# EAGLE board 6_channel_esp32_energy_meter_add-on (EAGLE 9.6.0)
CREVISION: 1.0; DESIGNER: Tisham Dhar
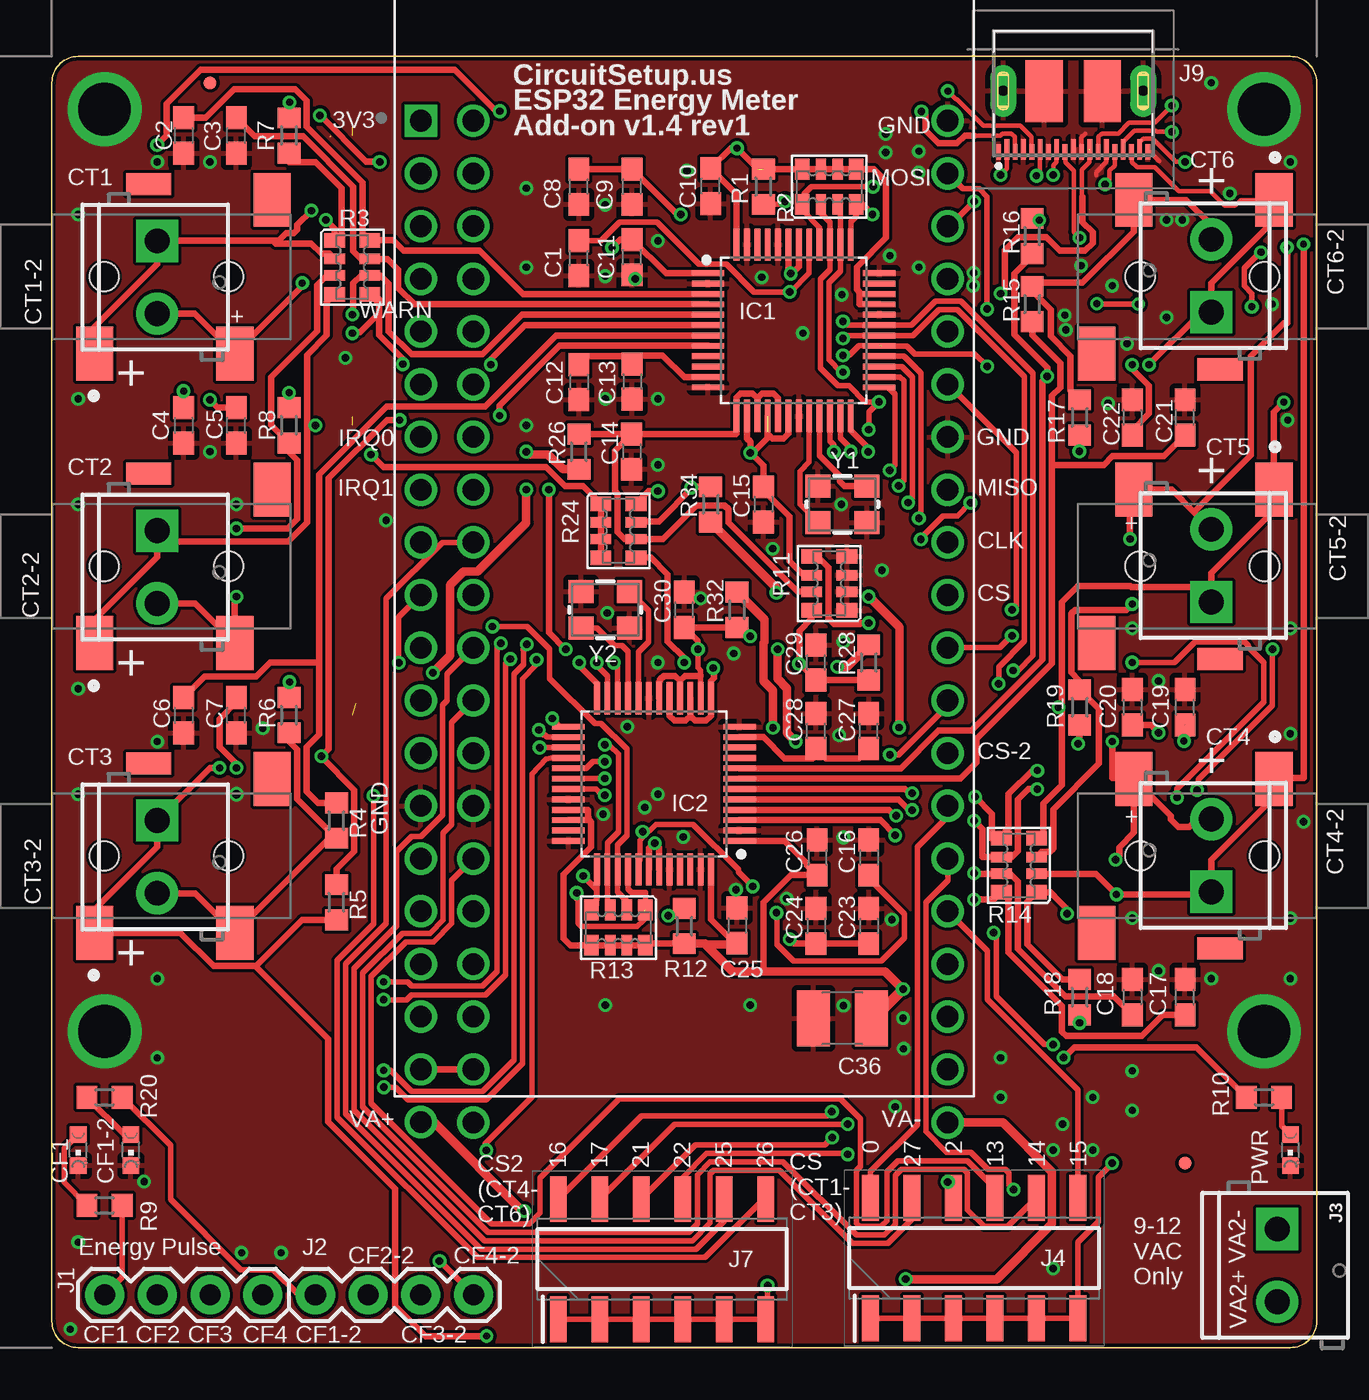
[diagram p3: board, top side]
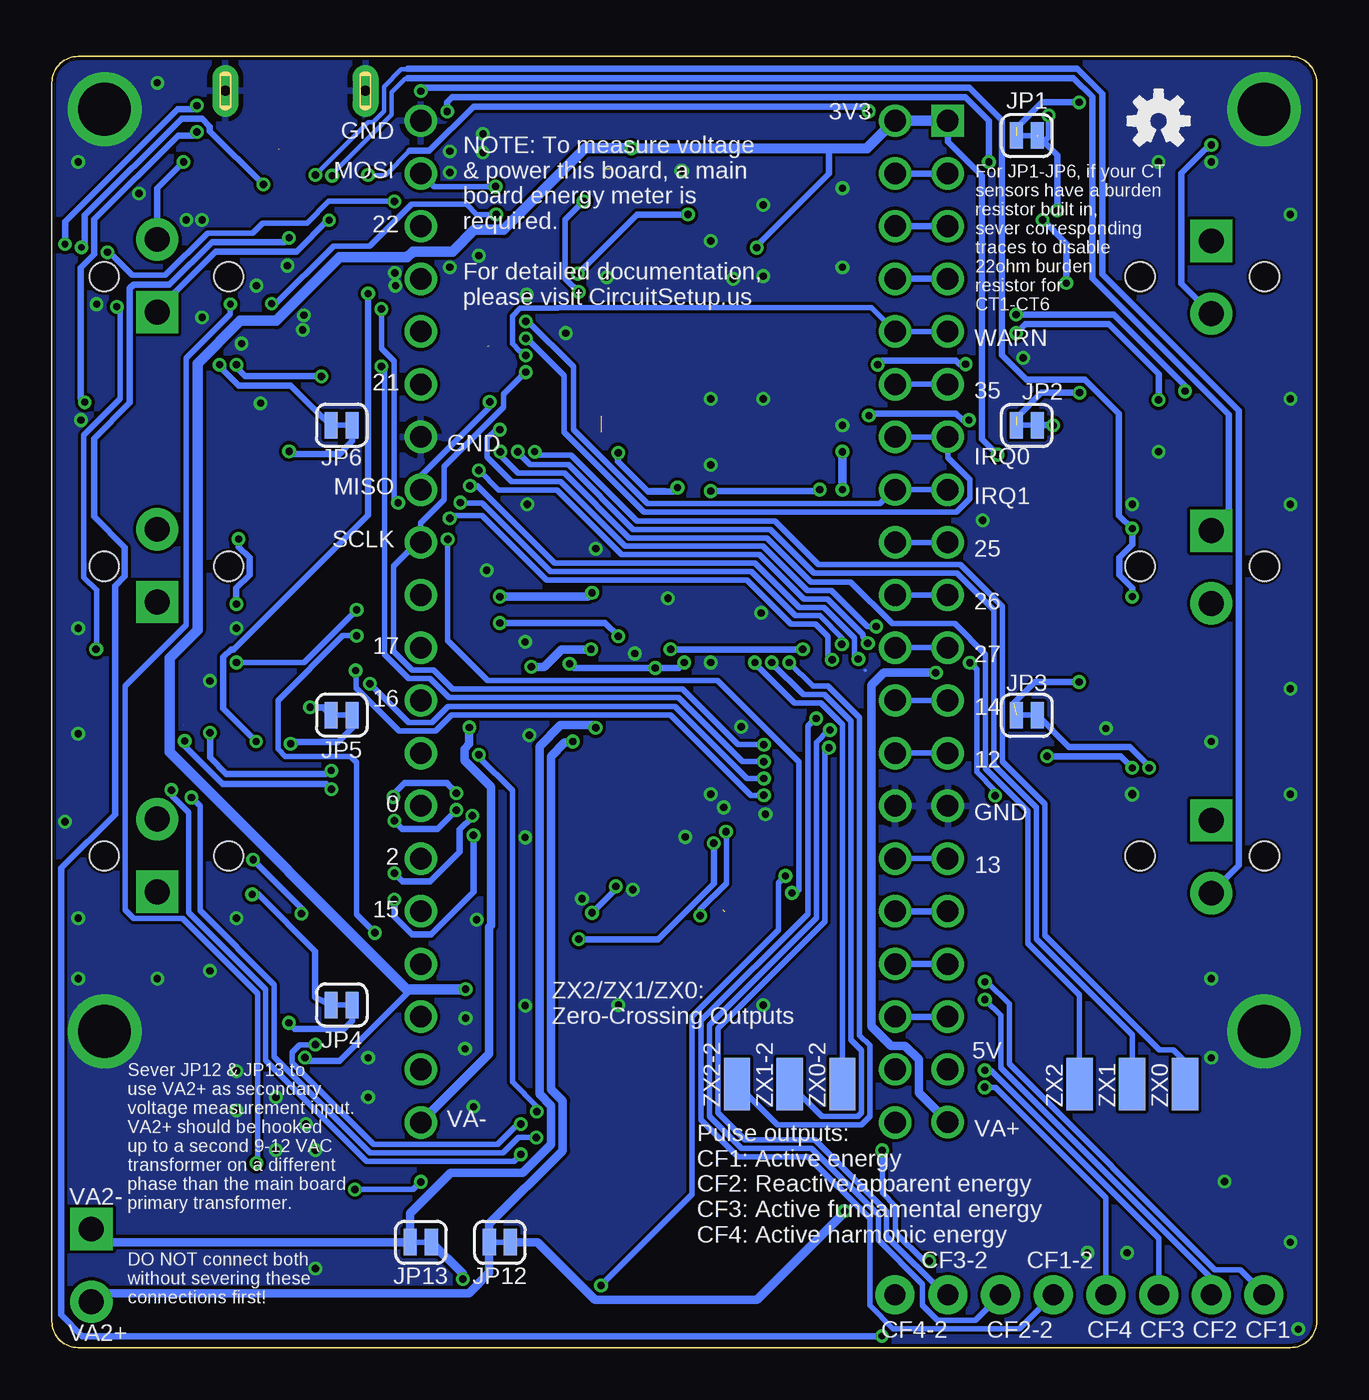
[diagram p4: board, bottom side, seen from below]

Size 60.96 x 62.23 mm. Coordinates in mm from the lower left corner, seen from the top.
Outline: 59.69,0 1.27,0 arc-90 0,1.27 0,60.96 arc-90 1.27,62.23 59.69,62.23 arc-90 60.96,60.96 60.96,1.27 arc-90 59.69,0
Copper layers (1*16): Top 0.035mm / dielectric 1.5mm / Bottom 0.035mm
Design rules "hackvana *": minimum track width 6mil, minimum drill 0.3mm, track to track 6mil, track to pad 6mil, pad to pad 6mil, via to via 6mil, smd to smd 0mil, copper to edge 6mil, drill to drill 6mil, minimum pad ring 10mil, minimum via ring 6mil, stop-mask expansion 4mil, vias tented up to drill 25mil, thermal gap 10mil
Net classes: 0 default: width 0.152 mm, drill 0.33 mm, clearance 0.152 mm; 1 pwr: width 0.305 mm, drill 0.356 mm, clearance 0.152 mm; 2 analog: width 0.203 mm, drill 0.33 mm, clearance 0.152 mm

## Footprints (pad centres in the part's own frame; a part is rotated, then mirrored left to right if it is on the bottom)
C0603 = smd 1.1 x 1: 1 -0.85,0; 2 0.85,0
C1210 = smd 1.6 x 2.7: 1 -1.4,0; 2 1.4,0
CHIPLED_0603 = smd 0.8 x 0.8: A 0,-0.75; C 0,0.75
SCREWTERMINAL-3.5MM-2 = drill 1.2 pad 2.032 square: 1 0,0 | drill 1.2 pad 2.032: 2 3.5,0
CUI_SJ2-35813B-SMT-TR = smd 1.8 x 2.6: 1 -3.7,-3.7; 2 3.05,-3.7; 10 4.85,3.7 | smd 2.184 x 1.067: 3 -1.1,4.462 | hole 1.4: -3.25,0; 2.75,0
FIDUCIAL-MICRO = smd 0.635 x 0.635: 1 0,0
QFP50P900X900X120-48 = smd 1.558 x 0.28: 1 -4.127,2.75; 2 -4.127,2.25; 3 -4.127,1.75; 4 -4.127,1.25; 5 -4.127,0.75; 6 -4.127,0.25; 7 -4.127,-0.25; 8 -4.127,-0.75; 9 -4.127,-1.25; 10 -4.127,-1.75; 11 -4.127,-2.25; 12 -4.127,-2.75; 25 4.127,-2.75; 26 4.127,-2.25; 27 4.127,-1.75; 28 4.127,-1.25; 29 4.127,-0.75; 30 4.127,-0.25; 31 4.127,0.25; 32 4.127,0.75; 33 4.127,1.25; 34 4.127,1.75; 35 4.127,2.25; 36 4.127,2.75 | smd 0.28 x 1.558: 13 -2.75,-4.127; 14 -2.25,-4.127; 15 -1.75,-4.127; 16 -1.25,-4.127; 17 -0.75,-4.127; 18 -0.25,-4.127; 19 0.25,-4.127; 20 0.75,-4.127; 21 1.25,-4.127; 22 1.75,-4.127; 23 2.25,-4.127; 24 2.75,-4.127; 37 2.75,4.127; 38 2.25,4.127; 39 1.75,4.127; 40 1.25,4.127; 41 0.75,4.127; 42 0.25,4.127; 43 -0.25,4.127; 44 -0.75,4.127; 45 -1.25,4.127; 46 -1.75,4.127; 47 -2.25,4.127; 48 -2.75,4.127
1X04 = drill 1.016 pad 1.88: 1 0,0; 2 2.54,0; 3 5.08,0; 4 7.62,0
SOP200P706X597-12N = smd 2.2 x 0.8: 1 -2.9,5; 2 -2.9,3; 3 -2.9,1; 4 -2.9,-1; 5 -2.9,-3; 6 -2.9,-5; 7 2.9,-5; 8 2.9,-3; 9 2.9,-1; 10 2.9,1; 11 2.9,3; 12 2.9,5
1X01-SM = drill 1.04: 1 0,0
PKS01940110 = smd 0.23 x 0.75: 1 3.6,5.825; 3 2.8,5.825; 5 2,5.825; 7 1.2,5.825; 9 0.4,5.825; 11 -0.4,5.825; 13 -1.2,5.825; 15 -2,5.825; 17 -2.8,5.825; 19 -3.6,5.825 | smd 0.23 x 1: 2 3.2,5.7; 4 2.4,5.7; 6 1.6,5.7; 8 0.8,5.7; 10 0,5.7; 12 -0.8,5.7; 14 -1.6,5.7; 16 -2.4,5.7; 18 -3.2,5.7 | smd 1.8 x 3: 21 -1.4,2.9; 22 1.4,2.9 | drill 0.5 pad 1.25 long: P$1 -3.375,2.875; P$2 3.375,2.875
1X19 = drill 1.04: 1 0,0; 2 2.54,0; 3 5.08,0; 4 7.62,0; 5 10.16,0; 6 12.7,0; 7 15.24,0; 8 17.78,0; 9 20.32,0; 10 22.86,0; 11 25.4,0; 12 27.94,0; 13 30.48,0; 14 33.02,0; 15 35.56,0; 16 38.1,0; 17 40.64,0; 18 43.18,0; 19 45.72,0
SMT-JUMPER_2_NC_TRACE_SILK = smd 0.635 x 1.27: 1 -0.508,0; 2 0.508,0
R0603 = smd 1 x 1.1: 1 -0.85,0; 2 0.85,0
RA1206-8 = smd 0.7 x 1: 1 -1.3,-0.85; 4 1.3,-0.85; 5 1.3,0.85; 8 -1.3,0.85 | smd 0.5 x 1: 2 -0.4,-0.85; 3 0.4,-0.85; 6 0.4,0.85; 7 -0.4,0.85
MODULE_ESP32-DEVKITC-32D = drill 1.04 square: 1 -12.7,19.76 | drill 1.04: 2 -12.7,17.22; 3 -12.7,14.68; 4 -12.7,12.14; 5 -12.7,9.6; 6 -12.7,7.06; 7 -12.7,4.52; 8 -12.7,1.98; 9 -12.7,-0.56; 10 -12.7,-3.1; 11 -12.7,-5.64; 12 -12.7,-8.18; 13 -12.7,-10.72; 14 -12.7,-13.26; 15 -12.7,-15.8; 16 -12.7,-18.34; 17 -12.7,-20.88; 18 -12.7,-23.42; 19 -12.7,-25.96; 20 12.7,19.76; 21 12.7,17.22; 22 12.7,14.68; 23 12.7,12.14; 24 12.7,9.6; 25 12.7,7.06; 26 12.7,4.52; 27 12.7,1.98; 28 12.7,-0.56; 29 12.7,-3.1; 30 12.7,-5.64; 31 12.7,-8.18; 32 12.7,-10.72; 33 12.7,-13.26; 34 12.7,-15.8; 35 12.7,-18.34; 36 12.7,-20.88; 37 12.7,-23.42; 38 12.7,-25.96
CRYSTAL-SMD-3.2X2.5MM = smd 1.2 x 1.1: 1 -1.175,-0.875; 2 1.175,-0.875; 3 1.175,0.875; 4 -1.175,0.875
SMD1,27-2,54 = smd 1.27 x 2.54: 1 0,0

## Placement (x,y rotation side)
C1  0.1uF  [C0603]  25.4,52.51 90 top
C2  .33uF  [C0603]  6.35,58.42 270 top
C3  .33uF  [C0603]  8.89,58.42 90 top
C4  .33uF  [C0603]  6.35,44.45 270 top
C5  .33uF  [C0603]  8.89,44.45 90 top
C6  .33uF  [C0603]  6.35,30.48 270 top
C7  .33uF  [C0603]  8.89,30.48 90 top
C8  10uF  [C0603]  25.4,55.95 90 top
C9  0.1uF  [C0603]  27.97,55.95 90 top
C10  0.1uF  [C0603]  31.75,55.98 90 top
C11  0.1uF  [C0603]  27.97,52.55 90 top
C12  10uF  [C0603]  25.4,46.53 270 top
C13  0.1uF  [C0603]  27.97,46.56 270 top
C14  18nF  [C0603]  27.94,43.18 270 top
C15  18nF  [C0603]  34.29,40.64 270 top
C16  0.1uF  [C0603]  39.37,23.62 270 top
C17  .33uF  [C0603]  54.61,16.89 90 top
C18  .33uF  [C0603]  52.07,16.89 270 top
C19  .33uF  [C0603]  54.61,30.86 90 top
C20  .33uF  [C0603]  52.07,30.86 270 top
C21  .33uF  [C0603]  54.61,44.83 90 top
C22  .33uF  [C0603]  52.07,44.83 270 top
C23  10uF  [C0603]  39.37,20.32 270 top
C24  0.1uF  [C0603]  36.83,20.32 270 top
C25  0.1uF  [C0603]  33.02,20.35 270 top
C26  0.1uF  [C0603]  36.88,23.62 270 top
C27  10uF  [C0603]  39.37,29.72 90 top
C28  0.1uF  [C0603]  36.83,29.72 90 top
C29  18nF  [C0603]  36.83,33.02 90 top
C30  18nF  [C0603]  30.48,35.56 90 top
C36  100uF/6.3V/1210  [C1210]  38.1,15.88 180 top
CF1  BLU  [CHIPLED_0603]  1.27,9.53 180 top
CF1-2  BLU  [CHIPLED_0603]  3.81,9.53 180 top
CT1  [SCREWTERMINAL-3.5MM-2]  5.08,53.34 270 top
CT1-2  SJ2-35813B-SMT-TR  [CUI_SJ2-35813B-SMT-TR]  5.77,51.61 0 top
CT2  [SCREWTERMINAL-3.5MM-2]  5.08,39.37 270 top
CT2-2  SJ2-35813B-SMT-TR  [CUI_SJ2-35813B-SMT-TR]  5.77,37.66 0 top
CT3  [SCREWTERMINAL-3.5MM-2]  5.08,25.4 270 top
CT3-2  SJ2-35813B-SMT-TR  [CUI_SJ2-35813B-SMT-TR]  5.77,23.7 0 top
CT4  [SCREWTERMINAL-3.5MM-2]  55.88,21.97 90 top
CT4-2  SJ2-35813B-SMT-TR  [CUI_SJ2-35813B-SMT-TR]  55.19,23.7 180 top
CT5  [SCREWTERMINAL-3.5MM-2]  55.88,35.94 90 top
CT5-2  SJ2-35813B-SMT-TR  [CUI_SJ2-35813B-SMT-TR]  55.19,37.66 180 top
CT6  [SCREWTERMINAL-3.5MM-2]  55.88,49.91 90 top
CT6-2  SJ2-35813B-SMT-TR  [CUI_SJ2-35813B-SMT-TR]  55.19,51.61 180 top
FD1  FIDUCIALUFIDUCIAL  [FIDUCIAL-MICRO]  7.62,60.96 0 top
FD2  FIDUCIALUFIDUCIAL  [FIDUCIAL-MICRO]  54.61,8.89 0 top
IC1  ATM90E32AS  [QFP50P900X900X120-48]  35.75,49.03 0 top
IC2  ATM90E32AS  [QFP50P900X900X120-48]  29.02,27.17 180 top
J1  [1X04]  10.16,2.54 180 top
J2  [1X04]  20.32,2.54 180 top
J3  [SCREWTERMINAL-3.5MM-2]  59.05,5.71 270 top
J4  TMM-103-01-T-D-SM  [SOP200P706X597-12N]  44.45,4.32 90 top
J5  PINHD1X1-SM1X01_SM  [1X01-SM]  20.32,10.85 0 top
J6  PINHD1X1-SM1X01_SM  [1X01-SM]  43.18,10.85 0 top
J7  TMM-103-01-T-D-SM  [SOP200P706X597-12N]  29.41,4.27 90 top
J8  PINHD1X1-SM1X01_SM  [1X01-SM]  17.78,10.87 0 top
J9  PKS019-4011-0  [PKS01940110]  49.23,63.45 180 top
J16  PINHD-1X19  [1X19]  20.32,59.13 270 top
JP1  [SMT-JUMPER_2_NC_TRACE_SILK]  13.97,58.42 0 bottom
JP2  [SMT-JUMPER_2_NC_TRACE_SILK]  13.97,44.45 0 bottom
JP3  [SMT-JUMPER_2_NC_TRACE_SILK]  13.97,30.48 0 bottom
JP4  [SMT-JUMPER_2_NC_TRACE_SILK]  46.99,16.51 180 bottom
JP5  [SMT-JUMPER_2_NC_TRACE_SILK]  46.99,30.48 180 bottom
JP6  [SMT-JUMPER_2_NC_TRACE_SILK]  46.99,44.45 180 bottom
JP12  [SMT-JUMPER_2_NC_TRACE_SILK]  39.37,5.08 0 bottom
JP13  [SMT-JUMPER_2_NC_TRACE_SILK]  43.18,5.08 0 bottom
LOGO1  OSHW-LOGOS  [OSHW-LOGO-S]  7.62,59.12 0 bottom
PWR  GRN  [CHIPLED_0603]  59.69,9.53 180 top
R1  10K  [R0603]  34.29,55.95 270 top
R2  10K  [RA1206-8]  37.47,55.95 0 top
R3  100  [RA1206-8]  14.48,52.07 270 top
R4  100  [R0603]  13.72,25.4 270 top
R5  100  [R0603]  13.72,21.46 270 top
R6  22  [R0603]  11.43,30.48 270 top
R7  22  [R0603]  11.43,58.42 270 top
R8  22  [R0603]  11.43,44.45 270 top
R9  1k  [R0603]  2.54,6.86 0 top
R10  1k  [R0603]  58.42,12.06 180 top
R11  1K  [RA1206-8]  37.47,36.83 90 top
R12  10K  [R0603]  30.48,20.32 90 top
R13  10K  [RA1206-8]  27.3,20.24 180 top
R14  100  [RA1206-8]  46.61,23.24 90 top
R15  100  [R0603]  47.24,50.29 90 top
R16  100  [R0603]  47.24,53.57 90 top
R17  22  [R0603]  49.53,44.83 90 top
R18  22  [R0603]  49.53,16.89 90 top
R19  22  [R0603]  49.53,30.86 90 top
R20  1k  [R0603]  2.54,12.06 0 top
R24  20K  [RA1206-8]  27.3,39.37 270 top
R26  20k 1/4W  [R0603]  25.4,43.18 270 top
R28  20k 1/4W  [R0603]  39.37,33.02 90 top
R32  20k 1/4W  [R0603]  33.02,35.56 90 top
R34  20k 1/4W  [R0603]  31.75,40.64 270 top
U1  ESP32-DEVKITC-32D  [MODULE_ESP32-DEVKITC-32D]  30.48,39.37 0 top
Y1  16.384MHz  [CRYSTAL-SMD-3.2X2.5MM]  38.1,40.64 0 top
Y2  16.384MHz  [CRYSTAL-SMD-3.2X2.5MM]  26.67,35.56 180 top
ZX0  WIREPADSMD1,27-254  [SMD1,27-2,54]  6.35,12.7 0 bottom
ZX0-2  WIREPADSMD1,27-254  [SMD1,27-2,54]  22.86,12.7 0 bottom
ZX1  WIREPADSMD1,27-254  [SMD1,27-2,54]  8.89,12.7 0 bottom
ZX1-2  WIREPADSMD1,27-254  [SMD1,27-2,54]  25.4,12.7 0 bottom
ZX2  WIREPADSMD1,27-254  [SMD1,27-2,54]  11.43,12.7 0 bottom
ZX2-2  WIREPADSMD1,27-254  [SMD1,27-2,54]  27.94,12.7 0 bottom

## Tracks (layer width: path | path; a pad name or v marks a point on that pad's centre or on a via)
!CS  (via drill 0.33, 0.36)
  Top 0.254: R2.4 38.77,54.54 38.5,54.27 IC1.37 | J4.1 J4.2 J4.3 J4.4 J4.5 J4.6 49.45,5.07 50.43,6.05 50.43,8.22 v51.1,8.89 | v52.36,50.29 50.39,50.29 v50.37,50.32
  Top 0.305: v39.55,54.61 39.06,55.1 R2.4
  Bottom 0.254: v51.1,8.89 51.05,8.94 51.05,17.07 54.66,20.68 57.01,20.68 57.43,21.09 57.43,31.88 54.48,34.83 54.48,47.69 52.36,49.82 v52.36,50.29 | v39.55,54.61 40.48,54.61 40.98,55.11 43.62,55.11 45.64,53.09 47.39,53.09 50.22,50.27 50.32,50.27 v50.37,50.32
!CS-2  (via drill 0.36)
  Top 0.254: 26,21.32 26.27,21.59 IC2.37 | R13.4 26.26,21.35 26.26,22.08 v25.6,22.73 | v34.49,3 34.49,1.45 J7.6 J7.5 J7.4 J7.3 J7.2 J7.1
  Top 0.305: 26,21.32 R13.4
  Bottom 0.254: v25.6,22.73 25.93,22.4 25.93,20.12 30.1,15.96 30.1,7.39 v34.49,3
!RESET  (via drill 0.36)
  Top 0.254: IC1.41 36.5,51.79 35.59,50.88 v35.56,50.88 33.84,50.88 32.51,52.21 31.2,52.21 29.18,54.23 27.35,54.23 26.48,53.36 C1.2 | v35.33,55.24 35.19,55.1 R1.2
  Bottom 0.254: v35.56,50.88 35.84,51.16 35.86,51.16 36.22,51.51 36.22,54.36 v35.33,55.24
!RESET2  (via drill 0.36)
  Top 0.254: 28.47,24.58 29.11,25.22 30.91,25.22 33.08,23.04 33.08,22.92 v33.78,22.23 | IC2.41 28.27,23.43 28.34,23.5 28.34,24.45 28.47,24.58 | R12.2 30.13,20.82 v29.71,20.82 | v28.47,24.87 28.47,24.58 | v34.92,20.95 34.95,20.93 34.95,19.43 35.74,18.64 39.99,18.64 41.09,19.75 41.09,20.89 39.37,22.61 C16.2
  Bottom 0.254: v29.71,20.82 29.71,21.11 28.45,22.38 28.45,24.85 v28.47,24.87 | v34.92,20.95 33.78,22.1 v33.78,22.23
CF1  (via drill 0.36)
  Top 0.254: IC1.25 40.31,46.28 40.62,45.97 40.62,42.53 v40.38,42.28 | v21.63,33.95 21.46,33.77 21.46,18.13 20.76,17.43 17.34,17.43 17.14,17.63 v15.99,17.63 | R9.2 3.39,3.39 J1.4
  Bottom 0.254: v21.63,33.95 21.63,34 21.87,34.24 21.87,34.38 23.58,36.09 24.72,36.09 26.85,38.21 33.5,38.21 36.62,41.33 39.42,41.33 v40.38,42.28 | J1.4 2.54,2.62 3.67,3.76 4.9,3.76 14.82,13.68 14.82,16.56 15.89,17.63 v15.99,17.63
CF1-2  (via drill 0.36)
  Top 0.152: v24.12,30.32 v24.13,30.32
  Top 0.254: IC2.25 24.52,29.92 v24.13,30.32 | R20.2 5.71,9.74 5.71,7.14 9.1,3.76 10.66,3.76 11.88,2.54 J2.4
  Bottom 0.152: v24.12,30.32 v24.13,30.32 24.16,30.32
  Bottom 0.254: v24.12,30.32 24.16,30.32 24.53,29.96 24.53,20.91 29.67,15.77 29.67,10.98 27.88,9.19 24.51,9.19 21.54,6.22 21.54,2.04 20.42,0.91 14.33,0.91 12.84,2.4
  Bottom 0.305: 12.84,2.4 J2.4
CF2  (via drill 0.36)
  Top 0.254: IC1.26 40.88,46.78 41.06,46.6 41.06,41.79 v40.81,41.54 | v22.09,33.19 21.86,32.96 21.86,17.96 20.91,17.01 17.34,17.01 17.1,16.77 v15.99,16.77
  Bottom 0.254: v15.99,16.77 15.23,16.01 15.23,13.49 5.08,3.34 J1.3 | v40.81,41.54 40.47,41.54 36.74,37.81 27.06,37.81 24.93,35.68 23.75,35.68 22.28,34.21 22.28,33.38 v22.09,33.19
CF2-2  (via drill 0.36)
  Top 0.254: IC2.26 23.87,29.42 23.76,29.53 23.7,29.53 v23.46,29.77
  Bottom 0.254: J2.3 16.46,1.32 18.29,1.32 19,2.04 19,3.06 21.13,5.19 21.13,6.39 24.34,9.6 27.71,9.6 29.26,11.15 29.26,15.56 24.12,20.7 24.12,29.17 23.52,29.77 v23.46,29.77
CF3  (via drill 0.36)
  Top 0.254: IC1.27 40.97,47.28 41.48,46.78 41.48,40.93 v41.27,40.73 | 22.73,33.64 22.73,32.93 22.27,32.47 22.27,13.86 20.76,12.35 17.34,12.35 16.33,13.36 v15.99,13.36
  Top 0.305: v22.89,33.91 22.89,33.8 22.73,33.64
  Bottom 0.254: v41.27,40.73 41.25,40.7 40.23,40.7 36.93,37.4 27.25,37.4 25.12,35.27 23.95,35.27 22.89,34.21 v22.89,33.91 | v15.99,13.36 15.71,13.36 7.62,5.27 J1.2
CF3-2  (via drill 0.36)
  Top 0.254: IC2.27 v23.51,28.92
  Bottom 0.254: 17.91,2.54 20.73,5.36 20.73,6.56 24.17,10 27.55,10 28.85,11.31 28.85,15.39 23.71,20.53 23.71,28.72 v23.51,28.92
  Bottom 0.305: 17.91,2.54 J2.2
CF4  (via drill 0.36)
  Top 0.254: v41.79,39.97 41.88,40.06 41.88,46.97 41.07,47.78 IC1.28 | 23.31,33.1 23.31,32.86 22.68,32.23 22.68,13.69 20.93,11.94 17.17,11.94 16.57,12.55 v16,12.55
  Top 0.305: v23.36,33.15 23.31,33.1
  Bottom 0.254: v41.79,39.97 | v41.79,39.97 41.66,40.09 40.22,40.09 37.12,36.99 27.46,36.99 25.33,34.87 24.16,34.87 23.56,34.27 23.56,33.36 v23.36,33.15 | J1.1 10.16,7.21 15.49,12.55 v16,12.55
CF4-2  (via drill 0.36)
  Top 0.254: IC2.28 24.09,28.42 23.81,28.37 23.15,27.65 23.15,12.1 20.87,9.82 21.07,9.63 v20.94,9.51 | v18.68,4.18 J2.1
  Bottom 0.254: v20.94,9.51 20.94,7.45 20.3,6.82 20.3,5.54 18.94,4.18 v18.68,4.18
GND  (via drill 0.35, 0.4, 2.54)
  Top 0.229: J9.19 | J9.11 49.62,58.34 49.8,58.52 | 50.83,57.21 J9.14 50.83,57.16 50.33,56.66 50.33,56.52 | J9.19 52.95,57.62 53.38,57.19
  Bottom 0.152: 21.79,32.64 21.73,32.65
  other vias: 40.64,11.61 4.45,8 5.08,57.15 7.62,57.15 29.21,53.34 2.54,59.69 58.42,59.69 2.54,15.24 36.2,48.9 38.05,40.64 40.39,52.63 34.21,51.59 29.21,42.55 38.07,50.75 29.21,45.72 30.61,56.72 41.78,57.66 7.62,43.18 16.1,39.88 5.08,29.21 10.16,29.84 5.08,13.97 1.27,26.67 1.27,31.75 1.27,40.64 1.27,45.72 1.27,54.61 8.89,40.64 8.89,26.67 22.86,55.88 22.86,52.07 26.67,45.72 22.86,44.45 28.12,51.51 14.15,47.7 55.88,17.78 53.34,18.16 58.42,15.24 29.21,26.67 28.57,26.04 26.77,35.41 27.73,29.93 30.43,24.61 26.57,25.7 59.69,57.15 38.15,24.59 53.34,32.13 50.9,45.52 40.18,58.5 55.88,60.96 54.48,54.36 59.56,44.7 59.69,34.67 59.69,29.59 59.69,20.7 52.07,34.67 51.82,48.39 52.07,20.7 34.75,38.51 52.07,11.43 26.67,16.51 26.67,51.64 26.67,55.07 35.41,21.64 59.69,17.78 1.27,5.08 0.89,0.89 31.27,36.12 11.05,4.57 9.14,4.57 37.95,29.51 5.08,17.78 48.26,3.81 32.97,22.07 29.21,33.02 40.01,37.47 40.49,20.62 32.87,33.45 38.15,34.01 33.66,16.51 38.15,16.48 41.78,56.64 40.18,57.61 41.78,52.07 53.72,49.66 56.77,55.63 53.72,54.36 58.8,50.29 49.61,52.15 51.1,51.18 60.33,25.35 48.87,49.05 48.82,49.76 44.42,51.79 44.4,51.18 50.16,12.06 52.07,13.34 50.16,9.53 48.26,9.53 48.72,10.77 45.72,13.97 45.72,12.06 41.02,15.88 41.05,14.4
  pour Top (rank 2): 0,62.23 61,62.23 61,0 0,0
  pour Bottom (rank 2): -0.64,62.87 61.59,62.87 61.59,-0.64 -0.64,-0.64
IA+  (via drill 0.35, 0.36)
  Top 0.229: J9.2 46.02,56.82 v45.72,56.52
  Top 0.305: R7.2 11.43,57.13 12.71,57.13 13.96,55.87 13.96,53.7 R3.1 13.63,53.94 v13.21,54.36 | v12.06,51.31 12.06,51.16 CT1-2.2 6.89,49.84 CT1.2 | v21.59,59.59 21.4,59.59 19.4,61.58 7.18,61.58 5.54,59.95 5.54,58.42 v5.08,57.96
  Bottom 0.229: v45.72,56.52 44.88,56.52 43.72,57.67
  Bottom 0.305: v13.21,54.36 12.06,53.21 v12.06,51.31 | 43.72,57.67 42.78,57.67 40.64,59.82 21.82,59.82 v21.59,59.59 | CT1.2 6.53,51.28 6.53,56.6 5.34,57.78 5.26,57.78 v5.08,57.96
IA+-2  (via drill 0.33, 0.35)  (1 unrouted)
  Top 0.229: 49.67,55.46 49.64,55.49 49.64,56.78 50.01,57.14 50.01,57.73
  Top 0.305: R18.2 48.71,17.74 47.02,19.43 47.02,21.5 R14.1 48.15,21.94 48.3,21.8 48.3,21.77 48.93,21.14 v48.93,20.91 | v51.26,23.51 51.44,23.69 51.44,24.11 52.14,24.82 CT4-2.2 | CT4.2 55.2,25.47 54.82,25.09 54.3,25.09 53.92,25.47 53.92,25.62 CT4-2.2 | v51.12,29.21 51.12,27.46 52.07,27.46 CT4-2.2 | v45.72,50.8 45.93,51.01 45.93,52.89 46.57,53.52 47.92,53.52 48.58,52.86 49.79,52.86 50.16,53.23 50.16,53.75 49.67,54.25 49.67,55.46
  Bottom 0.305: v51.26,23.51 48.93,21.18 v48.93,20.91 | v51.12,29.21 52.7,30.8 52.7,33.28 52.33,33.66 52.19,33.66 45.72,40.13 v45.72,50.8
IA-  (via drill 0.35, 0.36)  (1 unrouted)
  Top 0.229: J9.3 46.41,57.64 46.41,58.36 46.25,58.52 45.8,58.52 45.7,58.42 44.45,58.42
  Top 0.305: 13.35,52.47 R3.2 13.38,52.72 13,52.72 12.5,53.21 10.79,53.21 10.92,53.34 | CT1-2.1 2.07,49.21 5.08,52.23 CT1.1 10.92,53.34 | 10.92,53.34 11.29,53.71 11.64,53.71 11.82,53.89 11.82,54.11 v12.51,54.8 | v15.8,57.15 15.15,57.15 v12.92,59.38 | v41.91,59.58 42.09,59.4 42.09,58.68 42.73,58.05 43.63,58.05 44,58.42 44.45,58.42
  Bottom 0.305: v12.51,54.8 12.51,57.47 13.16,58.12 | 13.16,58.12 13.41,58.37 | v12.92,59.38 12.92,58.35 13.16,58.12 | v15.8,57.15 15.8,59.14 16.93,60.27 41.66,60.27 41.91,60.03 v41.91,59.58
IA--2  (via drill 0.33, 0.35)
  Top 0.229: v53.98,59.86 53.15,59.03 51.91,59.03 51.4,58.52 50.6,58.52 50.44,58.36 50.44,57.64 J9.13
  Top 0.305: R14.2 50.31,22.84 v51.31,21.84 55.75,21.84 CT4.1 55.88,23.5 58.89,26.51 CT4-2.1 58.9,27.46 60.33,27.46 v60.33,53.18
  Bottom 0.305: JP4.2 48.26,16.89 48.26,19.1 51,21.84 v51.31,21.84 | v53.98,59.86 54.15,59.68 54.9,59.68 60.33,54.26 v60.33,53.18
IAN
  Top 0.305: C3.2 9.79,58.38 12.11,58.38 14.52,55.96 14.52,52.84 14.89,52.47 R3.7 16.18,52.47 16.7,51.95 16.7,51.06 17.48,50.28 IC1.4
IAN-2  (via drill 0.36)
  Top 0.305: C18.2 51.17,16.94 48.85,16.94 46.56,19.23 46.56,22.47 46.25,22.78 45.82,22.78 R14.7 44.47,22.84 v44.45,22.86 | IC2.4 40.35,25.92 40.64,25.63 v40.69,25.63
  Bottom 0.305: v40.69,25.63 40.69,25.58 41.31,24.96 41.31,23.88 42.73,22.46 44.06,22.46 v44.45,22.85 v44.45,22.86
IAP
  Top 0.305: C2.1 7.41,59.27 8.79,60.65 11.72,60.65 12.29,60.09 12.29,58.84 14.98,56.15 14.98,53.72 R3.8 16.44,53.37 16.95,52.86 20.62,52.86 22.71,50.78 IC1.3
IAP-2  (via drill 0.36)
  Top 0.305: C17.1 53.55,16.04 52.52,15.01 48.89,15.01 48.67,15.23 48.67,16.47 46.11,19.04 46.11,21.59 R14.8 45.41,21.59 v44.45,21.59 | IC2.3 39.93,25.42 40.64,24.71 v40.64,24.69
  Bottom 0.305: v44.45,21.59 v44.44,21.58 44.44,20.76 43.6,19.92 42.68,19.92 40.64,21.96 v40.64,24.69
IB+  (via drill 0.35)
  Top 0.229: v43.18,60.56 43.56,60.18 43.61,60.18 44.89,58.9 46.67,58.9 47.21,58.36 47.21,57.64 J9.5
  Top 0.305: R3.3 13.25,51.67 12.79,51.22 12.79,48.99 10.57,46.77 10.57,44.45 R8.2 11.43,43.17 11.82,42.78 11.82,39.93 11.37,39.47 v8.89,39.47 | CT2.2 6.9,35.87 CT2-2.2 8.82,36.12 v8.89,36.2
  Bottom 0.229: v43.18,60.56 43.18,60.68 43.12,60.73
  Bottom 0.305: v8.89,36.2 8.89,36.61 9.52,37.24 9.52,38.07 8.89,38.7 v8.89,39.47 9.53,40.11 9.53,45.01 11.17,46.66 14,46.66 15.16,47.82 15.16,59.15 16.74,60.73 43.12,60.73
IB+-2  (via drill 0.33, 0.35)
  Top 0.229: 51.24,57.64 J9.15 51.23,56.97 50.97,56.71 50.97,56.26 v50.76,56.06
  Top 0.305: v52.07,35.84 51.79,35.56 49.32,35.56 49.14,35.38 49.14,32.53 49.53,32.14 R19.2 50.47,30.77 50.47,28.15 48.26,25.95 48.26,24.07 48.08,23.88 47.7,23.88 R14.3 | 55.04,40.28 53.97,41.35 CT5-2.2 52.07,41.27 51.96,41.17 v51.96,38.97 | 55.04,40.28 CT5.2 | v59.53,53.02 59.53,49.37 59.37,49.37 57.78,47.78 57.78,43.02 55.04,40.28
  Bottom 0.305: v52.07,35.84 52.07,36.61 51.44,37.24 51.44,38.07 51.96,38.59 v51.96,38.97 | v59.53,53.02 59.37,53.19 59.37,54.57 54.71,59.22 53.71,59.22 53.34,58.85 53.34,58.64 v50.76,56.06
IB-  (via drill 0.35)
  Top 0.229: v47.45,56.48 47.62,56.65 J9.6
  Top 0.305: 12.29,44.45 12.29,47.84 13.25,48.8 13.25,50.39 R3.4 | 12.29,44.45 v12.7,44.45 | CT2-2.1 2.07,35.09 5.08,38.1 CT2.1 5.61,38.84 11.38,38.84 12.29,39.75 12.29,44.45
  Bottom 0.229: v47.45,56.48 47.45,56.55 45.32,58.68 44.58,59.42 44.58,60.51 43.93,61.15 43.85,61.15 43.81,61.19
  Bottom 0.305: JP2.2 v12.7,44.45 | CT2.1 4.24,40.21 4.24,44.96 10.82,51.54 10.82,60.28 11.73,61.19 43.81,61.19
IB--2  (via drill 0.33, 0.35)
  Top 0.229: J9.16 51.64,57.77 51.64,58.11 52.18,58.65 53.21,58.65 53.26,58.59 v53.98,58.59
  Top 0.305: 48.67,30.86 48.67,35.94 49.44,36.7 51.98,36.7 52.03,36.65 55.17,36.65 CT5.1 55.88,37.33 58.89,40.34 CT5-2.1 58.9,41.43 58.9,45.09 v59.37,45.56 | 48.67,30.86 48.67,27.11 47.79,26.23 47.79,24.87 R14.4 | 48.67,30.86 v48.51,30.86
  Bottom 0.305: v48.51,30.86 47.88,30.86 JP5.2 | v59.37,45.56 59.56,45.75 59.56,52.04 58.91,52.69 58.91,54.38 54.87,58.42 54.15,58.42 v53.98,58.59
IBN  (via drill 0.35)
  Top 0.305: C5.2 8,45.3 v7.62,45.68 | v14.48,48.9 14.51,48.93 14.86,48.93 15.78,49.85 15.78,50.32 R3.5 15.55,50.77 15.78,50.54 15.78,48.79 16.92,47.65 v16.92,47.4 | v21.16,47.38 21.16,47.62 22.81,49.28 IC1.6
  Bottom 0.305: v16.92,47.4 17.22,47.4 17.38,47.57 20.97,47.57 v21.16,47.38 | v7.62,45.68 7.62,46.92 10.03,49.33 14.05,49.33 v14.48,48.9
IBN-2  (via drill 0.35, 0.36)
  Top 0.305: C20.2 52.96,30.01 v53.34,29.64 | IC2.6 41.11,26.92 41.31,26.72 v41.46,26.72 | v44.5,26.54 45.31,25.73 45.31,24.52 45.74,24.52 R14.5 45.76,24.67 46.11,25.02 46.11,26.68 47.24,27.81 v47.5,27.81
  Bottom 0.305: v53.34,29.64 53.34,28.43 52.56,27.66 47.78,27.66 47.63,27.8 v47.5,27.8 v47.5,27.81 | v41.46,26.72 41.92,27.18 41.92,27.22 43.96,27.22 44.5,26.68 v44.5,26.54
IBP  (via drill 0.35)
  Top 0.305: C4.1 v6.35,46.1 | IC1.5 22.66,49.78 20.77,47.88 17.33,47.88 16.24,48.98 16.24,51.28 15.85,51.67 R3.6 14.89,51.67 14.52,51.3 14.52,49.83 v14.48,49.79
  Bottom 0.305: v14.48,49.79 9.78,49.79 6.35,46.35 v6.35,46.1
IBP-2  (via drill 0.35, 0.36)  (1 unrouted)
  Top 0.152: 54.61,29.21 54.59,29.23 v54.56,29.23
  Top 0.305: C19.1 54.61,29.21 | IC2.5 40.8,26.42 41.31,25.91 v41.46,25.91 | v44.45,25.4 44.86,24.99 44.86,23.64 R14.6 46.27,23.64 46.56,23.94 46.56,26.42 47.06,26.92 v47.49,26.92
  Bottom 0.305: v54.56,29.23 54.56,29.01 52.73,27.17 47.75,27.17 v47.49,26.92 | v41.46,25.91 42.37,25 44.09,25 44.45,25.36 v44.45,25.4
IC+  (via drill 0.35)
  Top 0.229: v48.26,56.52 48.26,56.99 48.41,57.14 48.41,57.73 J9.8
  Top 0.305: R6.2 11.43,29.21 11.82,28.82 11.82,26.45 R4.2 13.37,24.55 CT3-2.2 6.91,21.9 CT3.2
  Bottom 0.229: 43.81,61.65 43.85,61.61 44.12,61.61 44.96,60.77 44.96,59.58 45.48,59.06 45.72,59.06 v48.26,56.52
  Bottom 0.305: CT3.2 5.08,21.92 3.76,23.24 3.76,45.16 10.34,51.74 10.34,60.44 11.54,61.65 43.81,61.65
IC+-2  (via drill 0.35)
  Top 0.229: J9.18 52.44,57.77 52.44,58.11 52.6,58.27 53.05,58.27 54.17,57.15 v54.61,57.15
  Top 0.305: R17.2 49.1,46.11 49.1,47.8 48.15,48.75 48.15,50.02 47.24,50.92 R15.2 47.42,51.32 49.67,51.32 52.14,53.79 CT6-2.2 54.68,55.31 55.88,54.12 CT6.2
  Bottom 0.305: v54.61,57.15 55.88,55.88 CT6.2
IC-  (via drill 0.33, 0.35)
  Top 0.229: J9.9 48.84,57.61 48.84,57.14 49.25,56.73 49.25,53.77 v49.53,53.49
  Top 0.305: 9.84,18.39 7.79,18.39 6.18,20 CT3-2.1 2.07,21.12 5.08,24.13 CT3.1 7.62,27.94 v8.08,27.94 | R5.2 12.06,20.61 9.84,18.39 | 9.84,18.39 9.82,18.37 13.31,14.88 13.31,10.87 16.54,7.64 16.54,2.02 18,0.56 v20.95,0.56
  Bottom 0.305: JP3.2 11.94,28.96 9.01,28.96 8.08,28.03 v8.08,27.94 | v20.95,0.56 59.49,0.56 60.5,1.57 60.5,23.11 57.91,25.7 57.91,36.7 57.44,37.18 57.44,38.56 58.93,40.05 58.93,43.82 57.2,45.55 57.2,51.05 57.02,51.23 55.3,51.23 53.24,53.29 49.73,53.29 v49.53,53.49
IC--2  (via drill 0.33, 0.35)
  Top 0.229: 52.04,57.64 J9.17 52.04,57.61 52.04,57.14 52.3,56.88 53.16,56.88 54.3,55.73 55.82,55.73 56.52,55.03 57.02,55.03 57.3,55.31 CT6-2.1
  Top 0.305: CT6-2.1 58.89,54.32 55.88,51.31 CT6.1 55.42,49.91 v52.88,47.37 | v47.6,54.34 47.33,54.34 R16.2
  Bottom 0.305: JP6.2 47.88,44.83 47.92,44.83 49.45,46.35 51.95,46.35 52.7,47.11 52.7,47.24 52.83,47.37 v52.88,47.37 | v47.6,54.34 47.66,54.34 49.17,52.83 53.05,52.83 55.88,50.01 CT6.1
ICN  (via drill 0.35)
  Top 0.305: v16.76,44.7 16.15,44.7 13.35,41.9 13.35,28.85 v12.99,28.5 12.99,28.46 14.57,26.88 14.57,23.92 13.72,23.07 R5.1 | C7.2 8.89,31.11 8.09,30.31 8.09,28.95 8.89,28.15 v8.89,27.94 | IC1.8 24.46,48.28 21.58,45.4 v21.58,44.92
  Bottom 0.305: v16.76,44.7 17.06,44.7 17.38,45.03 21.48,45.03 v21.58,44.92 | v8.89,27.94 9.45,28.5 v12.99,28.5
ICN-2  (via drill 0.35)
  Top 0.305: C22.2 52.07,44.2 52.88,45.01 52.88,46.36 52.07,47.16 v52.07,47.37 | R16.1 47.24,52.62 46.39,51.77 46.39,48.82 47.97,47.23 v47.97,46.81 47.74,46.59 47.74,33.16 44.32,29.73 42.73,29.73 40.91,27.92 IC2.8
  Bottom 0.305: v47.97,46.81 51.64,46.81 52.07,47.24 v52.07,47.37
ICP
  Top 0.305: 12.89,33.02 12.89,42.09 16.14,45.34 20.87,45.34 24.31,48.78 IC1.7 | 12.89,33.02 12.89,29.56 12.28,28.96 12.28,26.8 12.83,26.25 R4.1 | 12.89,33.02 10.51,33.02 9.84,32.35 7.37,32.35 C6.1
ICP-2
  Top 0.305: 48.2,42.55 48.2,45.88 48.6,46.28 48.6,47.45 47.24,48.81 R15.1 | 48.2,42.55 48.2,32.97 44.57,29.34 44.57,28.2 43.79,27.42 IC2.7 | 48.2,42.55 50.7,42.55 51.12,42.96 53.59,42.96 C21.1
IO0
  Top 0.254: J4.12 39.45,8.49 41.71,10.74 41.71,24.13 43.18,25.6 U1.33
IO2  (via drill 0.36)
  Top 0.254: U1.34 43.18,22.53 42.11,21.46 42.11,10.41 43.12,9.41 44.3,9.41 45.12,8.6 45.97,8.6 46.13,8.43 46.13,7.85 v46.35,7.62 | v43.18,7.99 43.45,7.72 J4.10
  Bottom 0.254: v46.35,7.62 43.55,7.62 v43.18,7.99
IO12
  Bottom 0.254: U1.13 J16.13
IO13
  Top 0.254: J16.15 19.26,22.51 19.26,20.44 18.39,19.56 17.06,19.56 15.38,17.88 15.38,11.77 21.18,5.97 23.01,5.97 23.54,6.5 23.54,8.19 27.34,11.99 38,11.99 38.96,11.02 38.96,8.73 38.77,8.54 38.77,6 38.93,5.84 39.97,5.84 40.24,6.12 40.24,8.48 40.77,9 44.13,9 45.45,7.69 J4.9
  Bottom 0.254: U1.15 J16.15
IO14
  Top 0.254: J16.12 19.26,30.13 19.26,25.21 18.85,24.8 18.85,20.61 18.22,19.97 16.9,19.97 14.97,18.05 14.97,11.6 21.02,5.56 30.7,5.56 31.1,5.96 31.1,8.33 31.73,8.95 35.24,8.95 38.77,5.43 40.13,5.43 40.65,5.95 40.65,8.31 40.93,8.6 43.97,8.6 44.13,8.43 44.13,6.64 44.93,5.84 46.07,5.84 J4.8
  Bottom 0.254: U1.12 J16.12
IO15
  Top 0.254: U1.35 45.09,19.12 45.09,16.79 49.45,12.43 J4.7
IO16  (via drill 0.36)
  Top 0.254: v37.59,11.38 37.39,11.18 28.42,11.18 J7.12 | v40.39,28.57 40.8,28.57 43.18,30.96 U1.31
  Bottom 0.254: v40.39,28.57 40.39,28.47 38.76,26.84 38.76,12.8 37.59,11.63 v37.59,11.38
IO17  (via drill 0.36)
  Top 0.254: U1.30 45.69,33.73 v46.27,34.31 | v45.39,19.99 45.52,19.86 45.52,16.93 47.85,14.61 v48.25,14.61 | v38.35,10.77 30.02,10.77 J7.11
  Bottom 0.254: v45.39,19.99 46.27,20.88 46.27,28.21 46.56,28.5 49.71,28.5 50.06,28.86 50.06,31.19 46.94,34.31 v46.27,34.31 | v48.25,14.61 48.28,14.58 49.02,14.58 49.38,14.22 49.38,13.72 45.45,9.79 39.49,9.79 38.51,10.77 v38.35,10.77
IO21  (via drill 0.35, 0.36)
  Top 0.254: U1.25 46.48,43.13 46.48,35.76 v46.27,35.56 | v52.07,33.02 54.1,33.02 55.09,34.01 57.5,34.01 57.67,33.84 57.67,33.77 58.42,33.02 58.42,31.11 54.23,26.92 v54.23,26.52 | v37.61,10.13 37.26,9.78 31.02,9.78 J7.10
  Bottom 0.254: v46.27,35.56 48.81,33.02 v52.07,33.02 | v37.61,10.13 38.46,10.13 39.21,9.38 45.62,9.38 50.24,14.01 50.24,17.48 53.82,21.06 53.82,26.11 v54.23,26.52
IO22  (via drill 0.35, 0.36)
  Top 0.254: v55.19,26.87 55.26,26.94 55.26,27.38 58.83,30.95 v58.83,33.66 | v57.83,50.16 57.83,50.8 57.47,51.17 57.47,52.02 58.24,52.79 v58.28,52.79 | J7.9 30.41,8.21 31.56,9.36 38.31,9.36 v38.35,9.31 | U1.22 43.26,54.05 v44.45,55.24
  Bottom 0.254: v58.83,33.66 58.8,33.68 58.8,36.5 59.42,37.12 59.42,43.97 57.66,45.74 57.66,49.99 v57.83,50.16 | v58.28,52.79 58.2,52.79 57.1,51.69 55.49,51.69 53.46,53.72 51.28,53.72 50.8,54.2 48.67,54.2 47.62,55.24 v44.45,55.24 | v55.19,26.87 55.19,26.62 54.36,25.79 54.36,20.98 50.65,17.26 50.65,13.84 45.78,8.97 38.69,8.97 v38.35,9.31
IO25
  Top 0.254: J16.9 18.82,38.81 16.11,36.1 16.11,20.45 14.16,18.5 14.16,11.27 20.68,4.75 31.04,4.75 32.41,6.12 J7.8
  Bottom 0.254: U1.9 J16.9
IO26  (via drill 0.35)
  Top 0.254: J7.7 34.31,7.17 31.48,4.34 20.51,4.34 13.76,11.1 13.76,18.66 15.5,20.41 v15.5,26.6 | v16.72,33.01 16.72,35.21 U1.10
  Bottom 0.254: U1.10 J16.10 | v15.5,26.6 15.5,26.86 16.39,27.74 16.39,32.68 v16.72,33.01
IO27
  Top 0.152: 38.61,5.03 38.6,5.03 38.56,5.06
  Top 0.254: J16.11 19.05,32.46 19.05,31.19 18.84,30.98 18.84,25.67 17.8,24.63 17.34,24.63 16.61,23.9 16.61,20.33 14.57,18.28 14.57,11.44 20.85,5.16 30.87,5.16 31.72,6.01 31.72,8.37 31.9,8.55 35.08,8.55 38.56,5.06 | J4.11 41.45,6.17 40.3,5.03 38.61,5.03
  Bottom 0.254: U1.11 J16.11
IO35
  Bottom 0.254: U1.6 J16.6
IRQ0  (via drill 0.36)
  Top 0.254: v38.12,48.64 38.26,48.78 IC1.30 41.49,48.78 42.74,50.03 43.65,50.03 46.88,46.8 46.88,34.06 45.64,32.81 v45.64,32 | IC2.30 v26.63,27.42
  Top 0.305: v26.63,27.42 v26.64,27.43
  Bottom 0.254: v26.64,27.43 27.46,27.43 30.93,30.9 41.87,30.9 42.64,30.13 43.77,30.13 v45.64,32 | J16.7 U1.7 17.78,42.88 16.72,41.83 16.72,40.91 17.37,40.27 32.42,40.27 36.27,44.12 36.27,46.84 38.08,48.64 v38.12,48.64
IRQ1  (via drill 0.36)
  Top 0.254: v38.12,49.45 38.3,49.28 IC1.31 41.42,49.28 42.57,50.44 43.82,50.44 47.29,46.97 47.29,33.35 46.58,32.64 v46.32,32.64 | IC2.31 26.22,26.92 26.52,26.62
  Top 0.305: 26.52,26.62 v26.64,26.62
  Bottom 0.152: J16.8 | v38.12,49.45 38,49.45 | 38,49.45
  Bottom 0.254: 38,49.45 35.81,47.27 35.81,44.23 32.25,40.67 21.05,40.67 20.37,41.35 J16.8 U1.8 | v26.64,26.62 27.26,26.62 31.13,30.5 41.7,30.5 42.47,29.72 44.22,29.72 46.3,31.8 46.3,32.61 v46.32,32.64
MISO  (via drill 0.36)
  Top 0.152: 39.69,45.58 39.69,45.56 v39.86,45.58
  Top 0.254: R2.2 37.06,54.67 37.5,54.23 IC1.39 37.5,51.96 37.03,51.49 37.03,47.21 37.89,46.35 38.41,46.35 39.19,45.58 39.69,45.58 v39.86,45.58 39.37,45.09 v39.37,44.25 | 27.7,21.53 27.27,21.97 IC2.39 27.27,24.24 27.71,24.68 27.71,28.85 26.48,30.09 26.17,30.09 24,32.26 24,33.66 22.9,34.75 v21.23,34.75
  Top 0.305: 27.7,21.53 R13.2
  Bottom 0.254: 39.56,44.25 39.98,43.82 39.98,42.91 38.8,41.73 36.45,41.73 33.34,38.62 26.68,38.62 24.55,36.49 23.38,36.49 21.64,34.75 v21.23,34.75 | v39.86,45.58 39.86,45.32 43.18,42 U1.27
  Bottom 0.305: v39.37,44.25 39.56,44.25
MOSI  (via drill 0.36)  (2 unrouted)
  Top 0.152: 28.57,20.8 28.51,20.59
  Top 0.254: IC1.40 37,53.98 36.16,54.82 R2.1 | R13.1 28.61,21.94 27.95,21.94 27.77,22.12 IC2.40 | v44.27,40.72 43.64,40.08 42.95,40.08 41.94,39.06 41.94,39.01 v41.88,38.96 | 25.35,21.59 25.35,20.47 25.53,20.29 28.21,20.29 28.51,20.59 28.51,21 | 25.29,21.65 v25.29,21.91 | 36.26,55.32 36.26,55.6 36.61,55.96 v39.58,55.96 | 45.03,50.1 v45.08,50.05 45.08,55.48 44.7,55.85 43.92,55.85 U1.21
  Top 0.305: 25.35,21.59 25.29,21.65 | 36.26,55.32 36.16,55.23 R2.1
  Bottom 0.254: U1.21 42.54,55.96 v39.58,55.96 | v45.08,50.05 45.08,48.15 44.47,47.55 44.47,40.91 v44.27,40.72 | 25.08,21.91 24.94,22.05 24.94,28.22 28.87,32.14 39.95,32.14 41.88,34.08 v41.88,38.96
  Bottom 0.305: v44.27,40.72 44.27,40.91 | v25.29,21.91 25.08,21.91
N$1  (via drill 0.35)  (1 unrouted)
  Top 0.305: 11.78,59.27 R7.1 11.46,59.3 v11.46,60.02
  Bottom 0.305: 14.48,58.85 14.41,58.85 13.24,60.02 v11.46,60.02
N$2  (via drill 0.35)  (1 unrouted)
  Top 0.305: R8.1 11.37,45.36 11.43,45.43 v11.43,46.02
  Bottom 0.305: 14.48,44.88 14.41,44.88 13.27,46.02 v11.43,46.02
N$3
  Top 0.254: R9.1 0.59,7.96 0.59,9.6 CF1.A
N$4  (via drill 0.35)  (1 unrouted)
  Top 0.305: R6.1 11.46,31.36 v11.46,32.08
  Bottom 0.305: v11.46,32.08 13.59,32.08 14.63,31.04
N$5  (via drill 0.36)
  Top 0.305: v49.53,15.65 R18.1
  Bottom 0.305: JP4.1 46.48,15.75 46.86,15.37 49.25,15.37 v49.53,15.65
N$6  (via drill 0.36)
  Top 0.305: v49.45,29.11 49.53,29.18 R19.1
  Bottom 0.305: JP5.1 46.48,29.87 47.17,29.18 49.38,29.18 v49.45,29.11
N$7  (via drill 0.36)
  Top 0.305: R17.1 v49.53,43.2 v49.52,43.2
  Bottom 0.305: JP6.1 46.48,43.69 47.1,43.07 49.4,43.07 v49.52,43.2
N$8
  Bottom 0.305: U1.2 J16.2
N$9
  Bottom 0.305: U1.3 J16.3
N$12
  Top 0.254: PWR.A 59.27,10.7 R10.1
N$14
  Top 0.254: CF1-2.A 3.48,10.28 R20.1
N$15
  Bottom 0.305: U1.4 J16.4
N$16
  Bottom 0.305: U1.16 J16.16
N$17
  Bottom 0.305: U1.17 J16.17
N$18
  Bottom 0.305: U1.18 J16.18
N$19
  Top 0.305: U1.19 J16.19
OSCI
  Top 0.254: IC1.20 36.5,42.67 36.05,42.22 36.05,40.64 Y1.1
OSCI2
  Top 0.254: IC2.20 28.27,33.53 28.75,34.01 28.75,35.53 Y2.1
OSCO
  Top 0.254: 38.19,41.52 37.95,41.76 37.95,42.04 37,42.99 IC1.21
  Top 0.305: 38.19,41.52 Y1.3
OSCO2
  Top 0.254: IC2.21 27.77,33.55 27.48,33.83 27.12,33.83 26.26,34.69 Y2.3
SCLK  (via drill 0.36)
  Top 0.152: 26.77,22.84 26.83,22.86 26.83,23.02 IC2.38
  Top 0.254: v38.12,47.02 38.04,47.02 37.44,47.62 37.44,51.32 38,51.88 IC1.38 38,54.73 37.87,54.86 | 26.7,29.01 26.91,29.01 27.3,28.61 27.3,24.85 26.77,24.32 IC2.38 | 26.91,21.21 26.77,21.34 26.77,22.84
  Top 0.305: R2.3 37.87,54.86 | 26.7,29.01 v26.64,29.06 | R13.3 26.91,21.21
  Bottom 0.254: v26.64,29.06 27.89,29.06 30.57,31.73 41.65,31.73 42.57,32.66 43.6,32.66 44.49,33.55 44.49,37.67 43.36,38.81 U1.28 43.18,39.75 42.06,40.87 42.06,42.46 39.19,45.32 39.19,45.95 v38.12,47.02
VA2+  (via drill 0.36)
  Top 0.406: v35.85,29.21 35.44,29.62 35.44,31.78 34.98,32.24 v34.98,33.66 | v37.85,32.81 38.31,32.81 R28.2
  Bottom 0.406: v35.85,29.21 35.85,29.16 36.25,29.16 36.91,28.5 36.91,12.45 36.35,11.89 36.35,9.49 39.88,5.96 JP12.1 39.88,3.6 40.86,2.62 58.65,2.62 J3.2 | v34.98,33.66 36.4,33.66 37.24,32.81 v37.85,32.81
VA2-  (via drill 0.36)
  Top 0.406: v34.75,29.87 34.75,31.67 34.29,32.14 34.29,33.95 34.34,34.01 34.34,35.09 R32.2
  Bottom 0.152: 43.81,5.21 JP13.1
  Bottom 0.406: v34.75,29.87 34.88,30 36.44,30 37.47,28.98 37.47,12.22 36.91,11.66 36.91,9.79 38.28,8.41 41.75,8.41 43.69,6.48 JP13.1 58.42,5.08 J3.1
VA+  (via drill 0.36)
  Top 0.406: J8.1 18.4,10.87 22.69,6.58 v22.76,6.58 | v18.36,32.52 19.18,33.35 19.18,36.74 19.85,37.41 20.52,37.41 22.86,39.74 v22.86,41.35 | R26.2 24.64,42.33 23.92,43.05 22.99,43.05 v22.86,43.18
  Bottom 0.406: v22.76,6.58 22.76,6.53 26.98,2.31 34.78,2.31 37.55,5.08 JP12.2 | v18.36,32.52 18.38,32.55 20.85,32.55 21.46,31.94 21.46,15.48 20.52,14.55 19.85,14.55 19.18,13.88 19.18,12.28 J8.1 | v22.86,43.18 v22.86,41.35
VA-  (via drill 0.36)
  Top 0.406: v41.15,3.3 45.54,3.3 48.21,5.97 48.21,8.46 45.83,10.85 J6.1 | v40.84,29.89 40.84,34.72 v39.37,36.2 | v34.92,36.39 34.92,36.62 R34.2
  Bottom 0.406: JP13.2 41.15,3.56 v41.15,3.3 | J6.1 39.88,14.15 39.88,20.27 39.8,20.34 39.8,27.02 41.08,28.29 41.08,28.86 40.84,29.09 v40.84,29.89 | v39.37,36.2 35.12,36.2 v34.92,36.39
VAN  (via drill 0.36)  (1 unrouted)
  Top 0.254: 33.5,44.45 IC1.14
  Top 0.305: v33.67,43.13 33.79,43.13 34.5,43.84 IC1.16 | C15.1 34.01,41.49 34.21,41.29 | R24.7 28.2,39.81 29.25,39.81 30.93,41.49 R34.1 30.85,41.49 v30.81,41.45 | C15.1 34.29,41.31 35.56,40.04 35.56,37.9 36.23,37.23 R11.6 | IC1.14 33.5,43.82 33.63,43.68 33.67,43.65 v33.67,43.13 | v33.67,43.13 34.29,42.51 C15.1 | 34.5,44.12 34.5,44.05 34.73,43.82 35.27,43.82 35.5,44.05 IC1.18
  Bottom 0.152: 31.75,41.28 31.75,41.25
  Bottom 0.305: 31.42,41.28 31.75,41.28 32.1,41.28 | v30.81,41.45 31.01,41.25 31.75,41.25 32.22,41.25 33.67,42.7 v33.67,43.13
VAN2  (via drill 0.36)
  Top 0.254: C30.1 31.14,34.05 v31.14,33.66 31.14,32.77 31.27,32.64 31.27,32.38 IC2.14
  Top 0.305: C30.1 R32.1 33.23,34.71 v33.66,34.29 | R24.8 28.77,41.28 v29.21,41.28 | v24.77,33.65 23.95,34.47 v23.95,41.35 | v39.37,34.92 38.99,34.92 38.94,34.88 37.69,34.88 37.42,35.14 37.42,37.61 36.76,38.27 R11.5 | 30.27,32.15 30.5,32.38 31.27,32.38 | 30.27,32.15 30.04,32.38 29.5,32.38 29.31,32.19 29.31,32.13 29.27,32.09 IC2.18 | IC2.16 30.27,32.15
  Bottom 0.305: v29.21,41.28 24.02,41.28 v23.95,41.35 | v24.77,33.65 25.16,33.65 25.16,33.66 v31.14,33.66 | v39.37,34.92 34.29,34.92 v33.66,34.29
VAP
  Top 0.305: C14.1 32.98,44.03 33,44.05 IC1.13 33,45.79 33.2,45.99 33.77,45.99 34,45.75 | R26.1 C14.1 | C14.1 27.14,43.23 27.14,41.27 27.26,41.15 27.26,39.31 27.6,38.97 R24.6 29.45,38.97 31.07,40.59 32.43,40.59 32.6,40.42 32.6,39.76 35.93,36.43 R11.7 | 34,45.75 IC1.15 | 34,45.75 34.23,45.99 34.77,45.99 35,45.75 IC1.17
VAP2  (via drill 0.36)
  Top 0.305: R11.8 36.62,35.14 36.02,34.55 36.02,32.98 36.09,32.91 C29.1 R28.1 | v31.88,32.75 31.91,32.73 31.91,32.27 31.77,32.13 IC2.13 31.77,30.45 31.54,30.21 31,30.21 30.77,30.44 30.77,30.38 IC2.15 30.77,30.45 30.54,30.21 30,30.21 29.77,30.45 IC2.17 | R24.5 28.87,38.07 29.67,37.27 29.67,34.04 30.48,33.23 v30.48,33.02
  Top 0.406: 36.09,32.91 36.05,32.91 v36.01,32.96
  Bottom 0.305: v30.48,33.02 30.74,32.75 v31.88,32.75 35.8,32.75 v36.01,32.96
VDD  (via drill 0.36)  (1 unrouted)
  Top 0.305: R1.1 R2.8 R2.7 R2.6 R2.5 39.63,56.8 40.21,56.22 40.21,53.5 38.79,52.08 38.79,51 38.92,50.88 | IC1.33 38.92,50.28 38.92,50.88 | IC1.34 39.02,50.78 38.92,50.88 | R12.1 28.68,19.47 R13.8 R13.7 R13.6 R13.5 25.88,19.53 25.88,19.39 24.99,19.39 24.66,19.73 24.66,22.8 25.98,24.12 25.98,25.32 25.85,25.45 | IC2.33 25.85,25.92 25.85,25.45 | 25.85,25.45 25.85,25.42 | IC2.34 25.85,25.42 | IC1.1 29.59,51.78 C11.2 27.38,53.4 v27,53.02 | R10.2 55.16,14.48 49.28,14.48 v48.77,13.97 | 34.03,56.8 v33.02,57.81 32.73,57.81 C10.2 33,55.58 IC1.48 | IC2.1 35.31,24.42 36.4,23.33 36.4,23.25 C26.2 35.61,22.77 34.29,21.45 34.29,18.13 | IC2.48 31.77,20.63 32.96,19.44 | v15.38,43.04 15.98,42.44 23.81,42.44 24.72,41.52 25.6,41.52 R24.1 R24.2 R24.3 R24.4 | 25.85,25.42 25.88,25.56 25.85,25.45
  Top 0.406: R12.1 31.47,19.47 31.5,19.44 | 31.5,19.44 32.8,18.13 34.29,18.13 40.01,18.13 40.16,18.13 v41.02,17.27 | 31.5,19.44 32.96,19.44 C25.2
  Top 0.508: v41.02,17.27 39.62,15.88 C36.1
  Bottom 0.305: v48.77,13.97 48.62,13.82 47.09,13.82 43.64,17.27 | v27,53.02 27,53.09 23.5,56.58 23.5,57.8 23.47,57.78 | v15.38,43.04 16.13,43.79 16.13,56.48 17.78,58.12 U1.1
  Bottom 0.406: U1.1 20.34,59.13 | 43.87,17.27 43.18,17.27 | J16.1
  Bottom 0.508: 20.34,59.13 21.67,57.81 23.47,57.78 v33.02,57.81 35.25,57.81 39.19,53.87 40.62,53.87 41.66,52.83 43.56,52.83 43.84,52.55 47.08,52.55 50.14,49.49 51.88,49.49 53.94,47.43 53.94,34.59 55.29,33.23 55.29,28.7 43.87,17.27 | v41.02,17.27 43.18,17.27 43.64,17.27 | U1.1 J16.1
VDD2  (via drill 0.36)
  Top 0.305: IC2.42 28.77,24.09 28.98,24.31 v29.06,24.31 29.27,24.09 IC2.43 | C23.2 C24.2 35.77,19.47 v35.56,19.68
  Bottom 0.305: v29.06,24.31 29.06,22.38 31.75,19.68 v35.56,19.68
VDD18  (via drill 0.36)
  Top 0.305: IC1.42 36,52.11 35.66,51.77 v35.61,51.77 35.5,51.88 IC1.43 | C8.2 C9.2 30.16,54.61 v30.3,54.61
  Bottom 0.305: v35.61,51.77 32.77,54.61 v30.3,54.61
VREF
  Top 0.152: C13.1 28.1,47.47 28.04,47.52
  Top 0.305: IC1.11 30.48,46.78 29.44,47.82 28.34,47.82 28.04,47.52 | C13.1 27.58,47.79 25.81,47.79 C12.1
VREF2
  Top 0.152: C28.1 36.83,28.89 36.84,28.79
  Top 0.305: IC2.11 34.29,29.42 35.3,28.41 36.66,28.41 36.84,28.58 36.84,28.79 | C27.1 38.89,28.39 37.31,28.39 C28.1
WARN  (via drill 0.36)  (1 unrouted)
  Top 0.152: IC2.29 24.92,27.94 24.92,27.92 | 39.85,48.28 39.85,48.26 IC1.29
  Top 0.254: v38.12,47.83 38.44,47.83 38.89,48.28 39.85,48.28 | v26.64,28.25 26.08,28.25 25.75,27.92 24.92,27.92 | v45.08,47.3 44.49,47.89 41.59,47.89 41.21,48.26 39.97,48.26
  Bottom 0.254: v26.64,28.25 27.68,28.25 30.75,31.32 41.81,31.32 42.74,32.25 43.77,32.25 44.92,33.4 44.92,47.14 | 38.1,47.83 38.28,48.01 38.39,48.01 38.76,48.38 38.76,49.72 38.39,50.09 36.59,50.09 36.62,50.11 21.46,50.11 J16.5 U1.5 J16.5
  Bottom 0.305: 38.1,47.83 v38.12,47.83 | 44.92,47.14 v45.08,47.3
ZX0  (via drill 0.35)
  Top 0.254: v37.69,43.18 37.69,43.5 37.5,43.69 IC1.22
  Bottom 0.254: 6.35,13.79 6.91,14.35 7.59,14.35 13.11,19.87 13.11,26.21 15.15,28.25 15.15,35.71 17.17,37.74 24.01,37.74 26.12,39.84 32.77,39.84 35.93,43.01 37.52,43.01 v37.69,43.18
  Bottom 0.305: 6.35,13.79 ZX0.1
ZX0-2  (via drill 0.35)
  Top 0.254: v27.08,33.02 27.12,33.02 27.27,32.87 IC2.22
  Bottom 0.254: ZX0-2.1 22.85,30.02 23.9,31.06 25.17,31.06 27.08,32.97 v27.08,33.02
ZX1  (via drill 0.36)
  Top 0.254: IC1.23 38,43.84 38.5,43.33 v38.5,43.18
  Bottom 0.254: ZX1.1 8.89,15.08 13.51,19.7 13.51,26.04 15.55,28.08 15.55,35.54 17.34,37.33 24.22,37.33 26.33,39.43 32.96,39.43 36.07,42.55 37.92,42.55 38.5,43.13 v38.5,43.18
ZX1-2  (via drill 0.36)
  Top 0.254: IC2.23 26.77,32.37 26.27,32.87 v26.27,33.02
  Bottom 0.254: v26.27,33.02 26.27,33 24.74,31.47 23.73,31.47 22.45,30.19 22.45,14.83 21.95,14.33 21.95,11.31 22.11,11.15 23.85,11.15 ZX1-2.1
ZX2  (via drill 0.36)
  Top 0.254: v39.34,43.18 39.34,43.35 38.5,44.2 IC1.24
  Bottom 0.254: ZX2.1 11.43,17 13.92,19.48 13.92,25.88 15.96,27.92 15.96,33.41 17.44,34.89 20.46,34.89 22.47,36.9 24.37,36.9 26.5,39.03 33.15,39.03 36.26,42.14 38.49,42.14 39.34,43
  Bottom 0.305: 39.34,43 v39.34,43.18
ZX2-2  (via drill 0.36)
  Top 0.254: v25.43,33.02 25.43,32.85 26.27,32.01 IC2.24
  Bottom 0.254: v25.43,33.02 24.28,31.88 23.56,31.88 22.04,30.36 22.04,15.06 21.54,14.56 21.54,11.15 21.94,10.74 25.98,10.74 ZX2-2.1

## Text on the board
tPlace: + | + | + | + | + | + | + | + | + | VA- | Energy Pulse | VA2- | 9-12 / VAC / Only | VA2+
bPlace: For JP1-JP6, if your CT / sensors have a burden / resistor built in, / sever corresponding / traces to disable / 22ohm burden / resistor for / CT1-CT6 | VA- | Sever JP12 & JP13 to / use VA2+ as secondary / voltage measurement input. / VA2+ should be hooked / up to a second 9-12 VAC / transformer on a different / phase than the main board / primary transformer. / / / DO NOT connect both / without severing these / connections first! | VA2+
tNames: 3V3 | GND | CircuitSetup.us / ESP32 Energy Meter / Add-on v1.4 rev1 | MOSI | WARN | IRQ0 | GND | IRQ1 | MISO | CLK | CS | CS-2 | GND | VA+ | 16 / / 17 / / 21 / / 22 / / 25 / / 26 | 0 / / 27 / / 2 / / 13 / / 14 / / 15 | CS2 / (CT4- / CT6) | CS / (CT1- / CT3) | CF2-2 | CF4-2 | CF1 | CF2 | CF3 | CF4 | CF1-2 | CF3-2
bNames: 3V3 | GND | MOSI | 22 | NOTE: To measure voltage / & power this board, a main / board energy meter is / required. / / For detailed documentation, / please visit CircuitSetup.us | WARN | 21 | 35 | IRQ0 | GND | MISO | IRQ1 | SCLK | 25 | 26 | 17 | 27 | 16 | 14 | 12 | 0 | GND | 2 | 13 | 15 | ZX2/ZX1/ZX0: / Zero-Crossing Outputs | 5V | VA+ | VA2- | Pulse outputs: / CF1: Active energy / CF2: Reactive/apparent energy / CF3: Active fundamental energy / CF4: Active harmonic energy | CF1-2 | CF3-2 | CF1 | CF2 | CF3 | CF4 | CF2-2 | CF4-2